# EAGLE design Pixie328 (EAGLE 6.5.0)
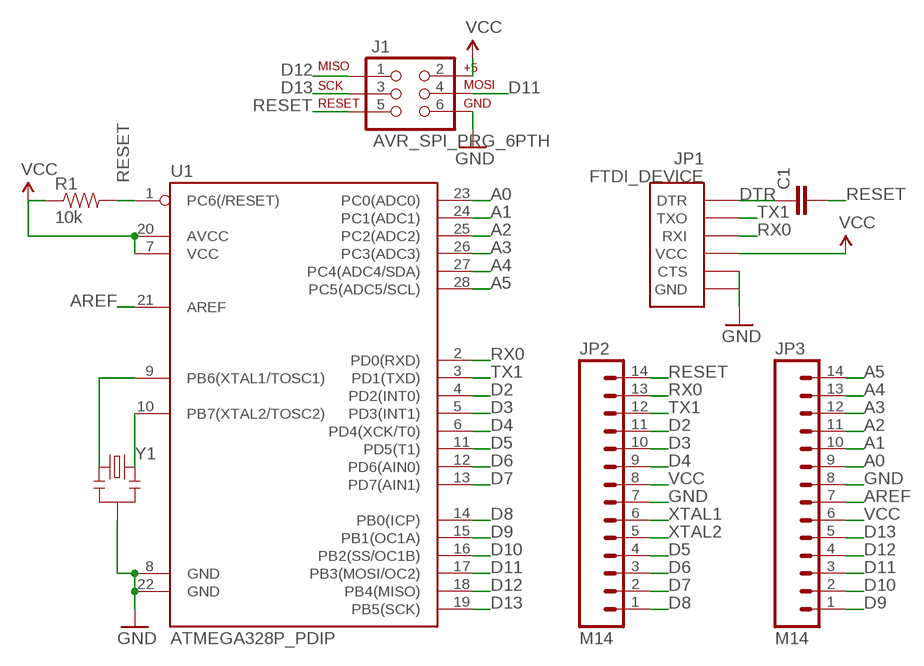
[diagram p0: schematic, sheet 1]

## Parts
C1  CAPEZ  [CAP-PTH-SMALLEZ]
J1  AVR_SPI_PRG_6PTH  [2X3]
JP1  FTDI_DEVICE  [FTDI_DEVICE_SIDE]
JP2  M14  [1X14]
JP3  M14  [1X14]
R1  10k  RESISTORAXIAL-0.3  [AXIAL-0.3]
U1  ATMEGA328P_PDIP  [DIL28-3]
Y1  RESONATORPTH  [RESONATOR-PTH]

## Nets
A0: JP3.9 U1.23(PC0(ADC0))
A1: JP3.10 U1.24(PC1(ADC1))
A2: JP3.11 U1.25(PC2(ADC2))
A3: JP3.12 U1.26(PC3(ADC3))
A4: JP3.13 U1.27(PC4(ADC4/SDA))
A5: JP3.14 U1.28(PC5(ADC5/SCL))
AREF: JP3.7 U1.21(AREF)
D2: JP2.11 U1.4(PD2(INT0))
D3: JP2.10 U1.5(PD3(INT1))
D4: JP2.9 U1.6(PD4(XCK/T0))
D5: JP2.4 U1.11(PD5(T1))
D6: JP2.3 U1.12(PD6(AIN0))
D7: JP2.2 U1.13(PD7(AIN1))
D8: JP2.1 U1.14(PB0(ICP))
D9: JP3.1 U1.15(PB1(OC1A))
D10: JP3.2 U1.16(PB2(SS/OC1B))
D11: J1.4 JP3.3 U1.17(PB3(MOSI/OC2))
D12: J1.1 JP3.4 U1.18(PB4(MISO))
D13: J1.3 JP3.5 U1.19(PB5(SCK))
DTR: C1.1 JP1.P$1(DTR)
GND: J1.6 JP1.P$5(CTS) JP1.P$6(GND) JP2.7 JP3.8 U1.8(GND) U1.22(GND) Y1.2
RESET: C1.2 J1.5 JP2.14 R1.P$2 U1.1(PC6(/RESET))
RX0: JP1.P$3(RXI) JP2.13 U1.2(PD0(RXD))
TX1: JP1.P$2(TXO) JP2.12 U1.3(PD1(TXD))
VCC: J1.2 JP1.P$4(VCC) JP2.8 JP3.6 R1.P$1 U1.7(VCC) U1.20(AVCC)
XTAL1: JP2.6 U1.9(PB6(XTAL1/TOSC1)) Y1.1
XTAL2: JP2.5 U1.10(PB7(XTAL2/TOSC2)) Y1.3

## Library data of the parts
C1 = SparkFun-Capacitors:CAP: Capacitor Standard 0603 ceramic capacitor, and 0.1" leaded capacitor.
J1 = barbary_enterprises:AVR_SPI_PRG_6: AVR ISP 6 Pin This is the reduced ISP connector for AVR programming. Common on Arduino. This footprint will take up less PCB space and can be used with a 10-pin to 6-pin adapter such as SKU: BOB-08508
JP1 = SparkFun-Connectors:FTDI_DEVICE: Connector which mates to FTDI basic or FTDI cable.
JP2 JP3 = barbary_enterprises:M14: Header 14 Standard 14-pin 0.1" header. Use with straight break away headers (SKU : PRT-00116), right angle break away headers (PRT-00553), swiss pins (PRT-00743), machine pins (PRT-00117), and female headers (PRT-00115).
R1 = SparkFun-Resistors:RESISTOR: Resistor Basic schematic elements and footprints for 0603, 1206, and PTH resistors.
U1 = SparkFun-DigitalIC:ATMEGA328P_PDIP: uC used in the Arduino 32kb flash, 1k EEPROM, 2k SRAM This is the through-hole version of this chip.
Y1 = SparkFun-FreqCtrl:RESONATOR: Resonator Small SMD resonator. Used, eg, on the Arduino Pro/ Pro Mini boards. 8MHz- XTAL-08895 16MHz- XTAL-08900

## Board
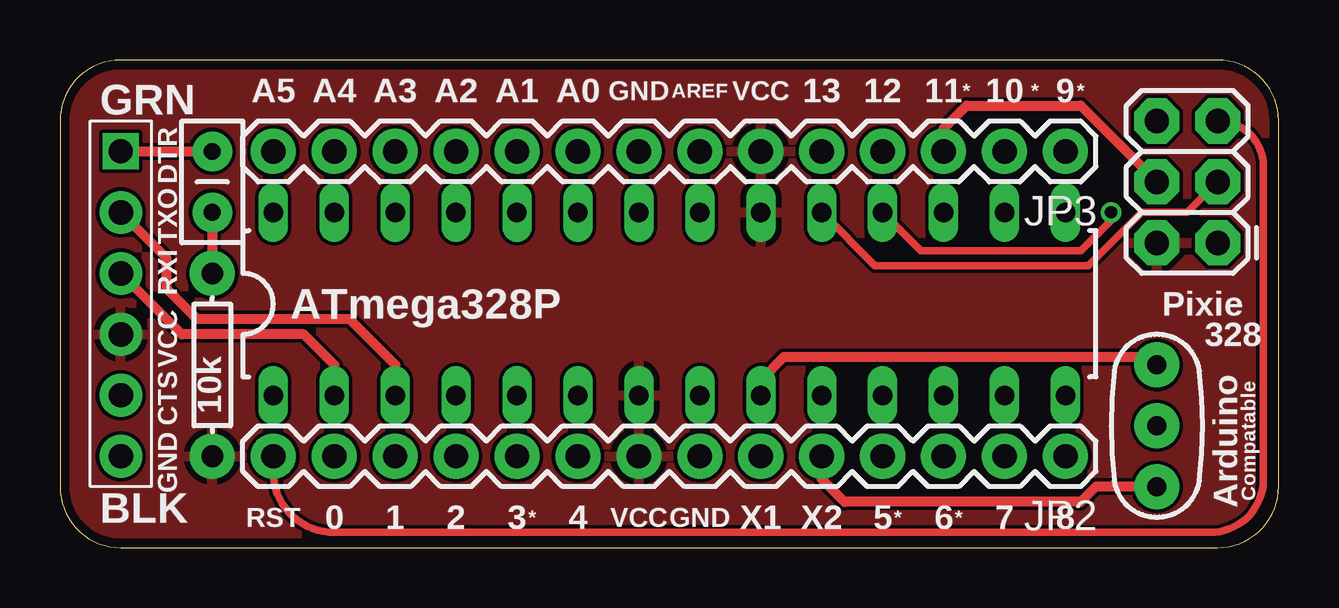
[diagram p1: board, top side]
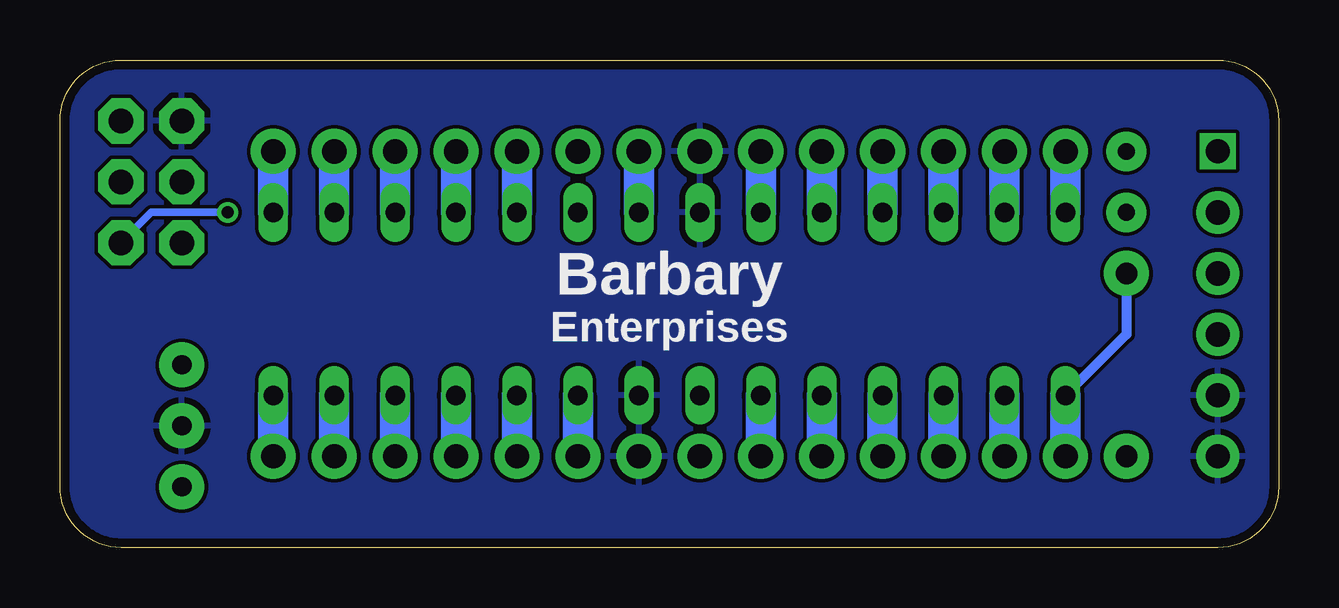
[diagram p2: board, bottom side, seen from below]

Size 50.8 x 20.32 mm. Coordinates in mm from the lower left corner, seen from the top.
Outline: 0,17.78 0,2.54 arc90 2.54,0 48.24,0 arc90 50.8,2.56 50.8,17.78 arc90 48.26,20.32 2.54,20.32 arc90 0,17.78
Copper layers (1*16): Top 0.0356mm / dielectric 1.5011mm / Bottom 0.0356mm
Design rules "LaenPCBOrder": minimum track width 6mil, minimum drill 13mil, track to track 6mil, track to pad 6mil, pad to pad 6mil, via to via 6mil, smd to smd 6mil, copper to edge 15mil, drill to drill 6mil, minimum pad ring 7mil, minimum via ring 7mil, stop-mask expansion 3mil, vias tented up to drill 0mil, thermal gap 10mil

### Footprints (pad centres in the part's own frame; a part is rotated, then mirrored left to right if it is on the bottom)
CAP-PTH-SMALLEZ = drill 0.7 pad 1.651: 1 0,0; 2 2.54,0
2X3 = drill 1.016 pad 1.88 octagon: 1 0,0; 2 0,2.54; 3 2.54,0; 4 2.54,2.54; 5 5.08,0; 6 5.08,2.54
FTDI_DEVICE_SIDE = drill 1 square: P$1 -6.35,0 | drill 1.016 pad 1.778: P$2 -3.81,0; P$3 -1.27,0; P$4 1.27,0; P$5 3.81,0; P$6 6.35,0
1X14 = drill 1.016 pad 1.88: 1 0,0; 2 2.54,0; 3 5.08,0; 4 7.62,0; 5 10.16,0; 6 12.7,0; 7 15.24,0; 8 17.78,0; 9 20.32,0; 10 22.86,0; 11 25.4,0; 12 27.94,0; 13 30.48,0; 14 33.02,0
AXIAL-0.3 = drill 0.9 pad 1.88: P$1 -3.81,0; P$2 3.81,0
DIL28-3 = drill 0.813 long: 1 -16.51,-3.81; 2 -13.97,-3.81; 3 -11.43,-3.81; 4 -8.89,-3.81; 5 -6.35,-3.81; 6 -3.81,-3.81; 7 -1.27,-3.81; 8 1.27,-3.81; 9 3.81,-3.81; 10 6.35,-3.81; 11 8.89,-3.81; 12 11.43,-3.81; 13 13.97,-3.81; 14 16.51,-3.81; 15 16.51,3.81; 16 13.97,3.81; 17 11.43,3.81; 18 8.89,3.81; 19 6.35,3.81; 20 3.81,3.81; 21 1.27,3.81; 22 -1.27,3.81; 23 -3.81,3.81; 24 -6.35,3.81; 25 -8.89,3.81; 26 -11.43,3.81; 27 -13.97,3.81; 28 -16.51,3.81
RESONATOR-PTH = drill 0.8 pad 1.88: 1 -2.54,0; 2 0,0; 3 2.54,0

### Placement (x,y rotation side)
C1  6.35,16.51 270 top
J1  48.26,12.7 90 top
JP1  2.54,10.16 270 top
JP2  41.91,3.81 180 top
JP3  41.91,16.51 180 top
R1  6.35,7.62 90 top
U1  25.4,10.16 0 top
Y1  45.72,5.08 270 top

### Tracks (layer width: path | path; a pad name or v marks a point on that pad's centre or on a via)
A0
  Bottom 1.27: JP3.9 U1.23
A1
  Bottom 1.27: JP3.10 U1.24
A2
  Bottom 1.27: JP3.11 U1.25
A3
  Bottom 1.27: JP3.12 U1.26
A4
  Bottom 1.27: JP3.13 U1.27
A5
  Bottom 1.27: JP3.14 U1.28
AREF
  Bottom 1.27: JP3.7 U1.21
D2
  Bottom 1.27: U1.4 JP2.11
D3
  Bottom 1.27: U1.5 JP2.10
D4
  Bottom 1.27: U1.6 JP2.9
D5
  Bottom 1.27: U1.11 JP2.4
D6
  Bottom 1.27: U1.12 JP2.3
D7
  Bottom 1.27: U1.13 JP2.2
D8
  Bottom 1.27: U1.14 JP2.1
D9
  Bottom 1.27: JP3.1 U1.15
D10
  Bottom 1.27: JP3.2 U1.16
D11
  Top 0.406: JP3.3 36.83,17.46 37.78,18.41 42.55,18.41 J1.4
  Bottom 1.27: JP3.3 U1.17
D12  (via drill 0.51)
  Top 0.305: v43.81,13.97 43.81,13.65 42.55,12.38 35.88,12.38 U1.18
  Bottom 0.305: J1.1 46.99,13.97 v43.81,13.97
  Bottom 1.27: JP3.4 U1.18
D13
  Top 0.305: J1.3 46.99,13.97 45.09,13.97 42.86,11.75 33.97,11.75 U1.19
  Bottom 1.27: JP3.5 U1.19
DTR
  Top 0.406: JP1.P$1 C1.1
GND
  pour Bottom: 0,17.78 0,2.54 arc90 2.54,0 48.26,0 arc90 50.8,2.54 50.8,17.78 arc90 48.26,20.32 2.54,20.32 arc90
RESET
  Top 0.305: J1.5 arc-90 50.16,15.88 50.16,2.86 arc-90 47.94,0.64 11.43,0.64 arc-90 8.89,3.17 JP2.14
  Top 0.406: C1.2 R1.P$2
  Bottom 0.406: R1.P$2 6.35,8.89 U1.1
  Bottom 1.27: U1.1 JP2.14
RX0
  Top 0.406: U1.2 11.43,7.62 10.16,8.89 5.08,8.89 JP1.P$3
  Bottom 1.27: U1.2 JP2.13
TX1
  Top 0.406: U1.3 13.97,7.62 12.06,9.53 5.71,9.53 4.45,10.79 4.45,12.06 JP1.P$2
  Bottom 1.27: U1.3 JP2.12
VCC
  pour Top: 0,17.78 0,2.54 arc90 2.54,0 48.24,0 arc90 50.8,2.56 50.8,17.78 arc90 48.26,20.32 2.54,20.32 arc90
XTAL1
  Top 0.406: U1.9 29.21,6.99 30.16,7.94 45.4,7.94 Y1.1
  Bottom 1.27: U1.9 JP2.6
XTAL2
  Top 0.406: Y1.3 43.18,2.54 42.55,1.91 32.7,1.91 31.75,2.86 JP2.5
  Bottom 1.27: U1.10 JP2.5

### Text on the board
tPlace: A5 | A4 | A3 | A2 | A1 | A0 | GND | AREF | VCC | 13 | 12 | 11 | * | 10 | * | 9 | * | ATmega328P | Pixie | 328 | Arduino | Compatable | RST | 0 | 1 | 2 | 3 | * | 4 | VCC | GND | X1 | X2 | 5 | * | 6 | * | 7 | 8
bPlace: Barbary | Enterprises